# Altium schematic sheet LCD.SchDoc: F1C100S-LCD
size A4
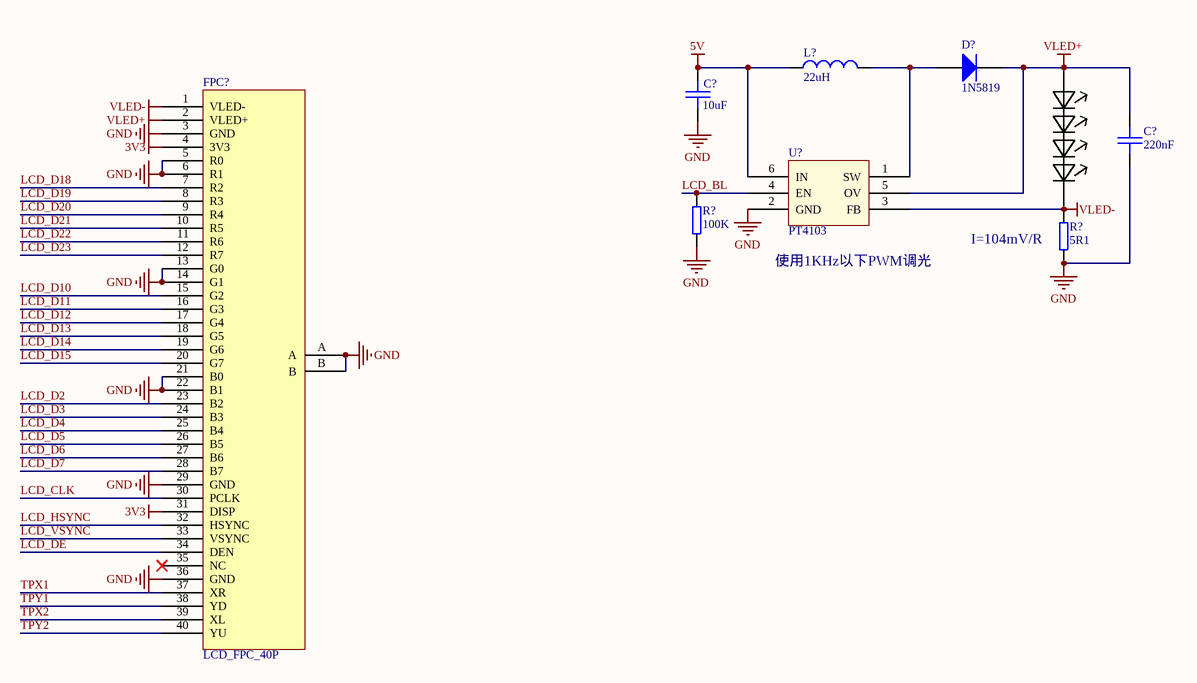
[diagram p0: LCD.SchDoc]

## Parts
(Parts that share a designator on the sheet are numbered #1, #2 ... from top to bottom, then left to right.)
C?#1  10uF  [CAP-1206]
C?#2  220nF  [CAP-0603]
D?  1N5819  [LC-SOD-123]
FPC?  LCD_FPC_40P  [FPC_40P]
L?  22uH  [L-PWR-06030]
R?#1  100K  [RES-0603]
R?#2  5R1  [RES-0603]
U?  PT4103  [SOT23-6]

## Nets
3V3: FPC?.4(3V3) FPC?.31(DISP)
5V: C?#1.2 L?.1 U?.6(IN)
GND: C?#1.1 C?#2.2 FPC?.3(GND) FPC?.5(R0) FPC?.6(R1) FPC?.13(G0) FPC?.14(G1) FPC?.21(B0) FPC?.22(B1) FPC?.29(GND) FPC?.36(GND) FPC?.A FPC?.B R?#1.1 R?#2.1 U?.2(GND)
VLED+: C?#2.1 D?.2(K) FPC?.2(VLED+) U?.5(OV)
VLED-: FPC?.1(VLED-) R?#2.2 U?.3(FB)
LCD_BL: R?#1.2 U?.4(EN)
LCD_CLK: FPC?.30(PCLK)
LCD_D2: FPC?.23(B2)
LCD_D3: FPC?.24(B3)
LCD_D4: FPC?.25(B4)
LCD_D5: FPC?.26(B5)
LCD_D6: FPC?.27(B6)
LCD_D7: FPC?.28(B7)
LCD_D10: FPC?.15(G2)
LCD_D11: FPC?.16(G3)
LCD_D12: FPC?.17(G4)
LCD_D13: FPC?.18(G5)
LCD_D14: FPC?.19(G6)
LCD_D15: FPC?.20(G7)
LCD_D18: FPC?.7(R2)
LCD_D19: FPC?.8(R3)
LCD_D20: FPC?.9(R4)
LCD_D21: FPC?.10(R5)
LCD_D22: FPC?.11(R6)
LCD_D23: FPC?.12(R7)
LCD_DE: FPC?.34(DEN)
LCD_HSYNC: FPC?.32(HSYNC)
LCD_VSYNC: FPC?.33(VSYNC)
TPX1: FPC?.37(XR)
TPX2: FPC?.39(XL)
TPY1: FPC?.38(YD)
TPY2: FPC?.40(YU)
NetD?_1: D?.1(A) L?.2 U?.1(SW)

Not connected (* = marked no-connect by the designer): FPC? 35(NC)*

## Notes on the sheet
- (near R?#2) I=104mV/R
- (near U?) 使用1KHz以下PWM调光
- Title
- Size:
- Date:
- A4
- Number:
- Time:
- Revision:
- Sheet
- of
- File:

## Library data of the parts
C?#1 = C_1206: 陶瓷贴片电容1206; tolerance: 10%; voltage: 50V; C_value: 10uF
C?#2 = C_0603: 陶瓷贴片电容0603; tolerance: 10%; voltage: 50V; ESR: 1.73mOhm; IRMS: 5.59A; C_value: 220nF; Series: X7R
D? = 1N5819: 肖特基二极管
FPC? = LCD_FPC_40P: 通用LCD连接器FPC40P
L? = L_Power: 功率电感; DCR: 0.1Ohm; IDC: 2.7A; tolerance: 20%; L_value: 22uH
R?#1 R?#2 = R_0603: 贴片电阻0603; tolerance: 5%; voltage: 50V; power: 0.063W
  R?#1: R_value: 100K
  R?#2: R_value: 5R1
U? = PT4103: 液晶背光驱动芯片